# Altium schematic sheet Sheet1.SchDoc
size A4
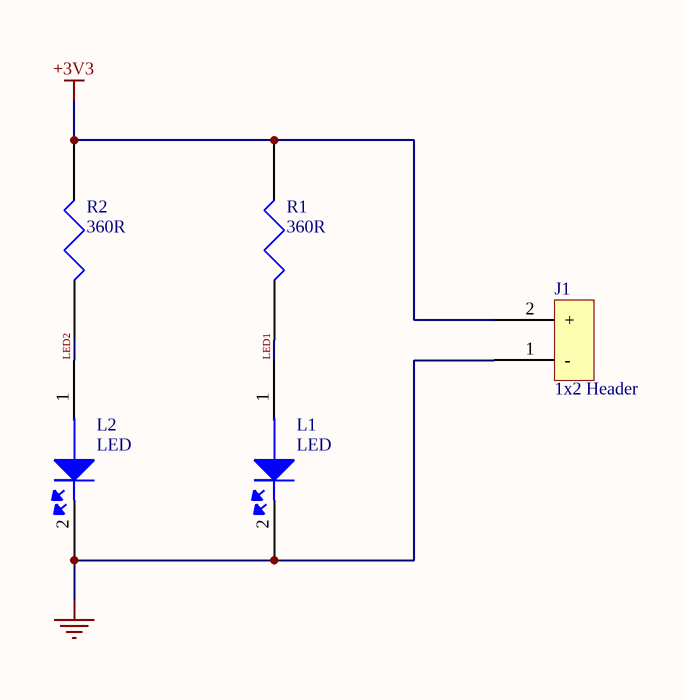
[diagram p0: Sheet1.SchDoc]

## Parts
J1  1x2 Header  [header1x2]
L1  LED  [LED]
L2  LED  [LED]
R1  360R  [R0805]
R2  360R  [R0805]

## Nets
+3V3: J1.2(+) R1.2 R2.2
GND: J1.1(-) L1.2 L2.2
LED1: L1.1 R1.1
LED2: L2.1 R2.1

## Library data of the parts
J1 = 22-23-2021: Connector Wire to Board Header 2 Position 2.54mm Solder Stra; Manufacturer: Molex; Number of Positions: 2; Gender: Male; Voltage Rating (DC): 250V; Insulation Resistance: 500GR; Contact Resistance: 10mR; Max Current Rating: 4A; Glow Wire Compliant: Non-compliant; Categori: Connectors, Interconnects; Approvals: UL,CSA; Supplier 1: Digi-Key; Manufacturer Part Number: 22-23-2021; RoHS: Yes; Category: Headers and Wire Housings; Stock 1: 56479; Pricing 1: 1=0,17000, 10=0,16100, 100=0,11150, 500=0,09438, 1000=0,07722, 5000=0,06864, 10000=0,06221 (USD); Mount: Through Hole; Color: White; Contact Plating: Tin,Copper; Contact Material: Brass; Housing Color: White; Housing Material: Nylon; Min Operating Temperature: 0°C; Max Operating Temperature: 75°C; Termination: Through Hole; Number of Contacts: 2; Number of Circuits: 2; Number of Rows: 1; Voltage Rating: 250V; Current Rating: 4A; Package Quantity: 3000; Packaging: Bulk; Orientation: Straight; Length: 5.08mm; Height: 10.67mm; Pitch: 2.54mm; Depth: 6.35mm; Halogen Free: Low Halogen; Lead Free: Lead Free; REACH SVHC: Unknown; Flammability Rating: UL94 V-0; ComponentLink1URL: https://datasheet.ciiva.com/19454/232266-19454304.pdf?src-supplier=Jameco; ComponentLink1Description: https://datasheet.ciiva.com/19454/232266-19454304.pdf?src-supplier=Jameco; ComponentLink2URL: https://datasheet.ciiva.com/5150/0022232021-pcb-headers-227096-5150681.pdf?src-supplier=Mouser; ComponentLink2Description: https://datasheet.ciiva.com/5150/0022232021-pcb-headers-227096-5150681.pdf?src-supplier=Mouser; ComponentLink3URL: https://datasheet.ciiva.com/22683/1834442-22683561.pdf?src-supplier=Element14; ComponentLink3Description: https://datasheet.ciiva.com/22683/1834442-22683561.pdf?src-supplier=Element14; ComponentLink4URL: https://datasheet.ciiva.com/11746/0900766b80d8f4d1-11746058.pdf?src-supplier=RSComponents; ComponentLink4Description: https://datasheet.ciiva.com/11746/0900766b80d8f4d1-11746058.pdf?src-supplier=RSComponents; ComponentLink5URL: https://datasheet.ciiva.com/30253/114200022232021-pcb-headers-30253002.pdf?src-supplier=Onlinecomponents.com; ComponentLink5Description: https://datasheet.ciiva.com/30253/114200022232021-pcb-headers-30253002.pdf?src-supplier=Onlinecomponents.com; ComponentLink6URL: https://datasheet.ciiva.com/9468/0022232021-pcb-headers-9468476.pdf?src-supplier=Avnet; ComponentLink6Description: https://datasheet.ciiva.com/9468/0022232021-pcb-headers-9468476.pdf?src-supplier=Avnet; ComponentLink7URL: https://datasheet.ciiva.com/18453/70190606-18453638.pdf?src-supplier=Allied+Electronics; ComponentLink7Description: https://datasheet.ciiva.com/18453/70190606-18453638.pdf?src-supplier=Allied+Electronics; ComponentLink8URL: https://datasheet.ciiva.com/16658/0022232021-pcb-headers-16658167.pdf?src-supplier=Avnet+Europe; ComponentLink8Description: https://datasheet.ciiva.com/16658/0022232021-pcb-headers-16658167.pdf?src-supplier=Avnet+Europe; Supplier Part Number 1: 900-0022232021-ND; Radiation Hardening: No
L1 L2 = LNJ926W8CRA: CHIPLED, 0603, BLUE, 11.5MCD, 470NM; Manufacturer: Panasonic SSG; Forward Voltage: 2.9V; Forward Current: 5mA; Lens Style: Rectangular; Number of LEDs: 1; Reverse Voltage: 5V; Categorie: Optoelectronics; Supplier 1: Digi-Key; Manufacturer Part Number: LNJ926W8CRA; RoHS: Yes; Category: LEDs; Stock 1: 11665; Pricing 1: 1=0,34000, 10=0,26300, 100=0,21780, 500=0,19932, 1000=0,19272 (USD); Mount: Surface Mount; Case/Package: 0603; Number of Pins: 2; Color: Blue; Case Code (Metric): 1608; Case Code (Imperial): 0603; Min Operating Temperature: -30°C; Max Operating Temperature: 85°C; Luminous Intensity: 11.5mcd; Wavelength: 470nm; Package Quantity: 5000; Packaging: Tape and Reel; Illumination Color: Blue; Test Current: 5mA; Dominant Wavelength: 470nm; Length: 1.6mm; Height: 0.35mm; Width: 0.8mm; REACH SVHC: Yes; Lead Free: Lead Free; ComponentLink1URL: https://datasheet.ciiva.com/4688/lnj926w8cra-cek-226062-4688285.pdf?src-supplier=Mouser; ComponentLink1Description: https://datasheet.ciiva.com/4688/lnj926w8cra-cek-226062-4688285.pdf?src-supplier=Mouser; ComponentLink2URL: https://datasheet.ciiva.com/8028/lnj926w8cra-cek-8028642.pdf?src-supplier=Element14; ComponentLink2Description: https://datasheet.ciiva.com/8028/lnj926w8cra-cek-8028642.pdf?src-supplier=Element14; ComponentLink3URL: https://datasheet.ciiva.com/11775/0900766b80f0a8cd-11775371.pdf?src-supplier=RSComponents; ComponentLink3Description: https://datasheet.ciiva.com/11775/0900766b80f0a8cd-11775371.pdf?src-supplier=RSComponents; Supplier Part Number 1: P13484CT-ND
R1 R2 = CRCW0805360RFKEA: Res Thick Film 0805 360 Ohm 1% 0.125W(1/8W) ±100ppm/C Molded SMD Automotive Paper T/R; Manufacturer: Vishay; Temperature Coefficient: 100ppm/°C; Max Power Dissipation: 125mW; Voltage Rating (DC): 150V; Categorie: Resistors; Supplier 1: Digi-Key; Manufacturer Part Number: CRCW0805360RFKEA; RoHS: Yes; Category: Chip SMD Resistors; Stock 1: 19728; Pricing 1: 1=0,10000, 10=0,06200, 100=0,02540, 1000=0,01142, 2500=0,00991 (USD); Case/Package: 0805; Number of Pins: 2; Weight: 0.000194oz; Contact Plating: Tin; Case Code (Metric): 2012; Case Code (Imperial): 0805; Number of Terminals: 2; Min Operating Temperature: -55°C; Max Operating Temperature: 155°C; Number of Terminations: 2; Features: Automotive AEC-Q200; Resistance: 360R; Tolerance: 1%; Packaging: Tape and Reel; Composition: Thick Film; Package Quantity: 10; Termination: SMD/SMT; Military Standard: Not; Power Rating: 125mW; Voltage Rating: 150V; Length: 2mm; Height: 0.45mm; Width: 0.049inch; Depth: 1.25mm; Radiation Hardening: No; Lead Free: Lead Free; REACH SVHC: Unknown; ComponentLink1URL: https://datasheet.ciiva.com/2467/dcrcwe3-2467773.pdf?src-supplier=Digi-Key; ComponentLink1Description: https://datasheet.ciiva.com/2467/dcrcwe3-2467773.pdf?src-supplier=Digi-Key; Supplier Part Number 1: 541-360CCT-ND